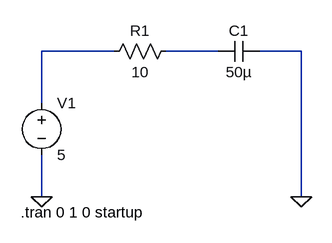
[diagram p0: schematic RC.asc]
RC.asc, the LTspice schematic file:
Version 4
SHEET 1 880 680
WIRE 144 64 32 64
WIRE 304 64 224 64
WIRE 432 64 368 64
WIRE 32 144 32 64
WIRE 32 288 32 224
WIRE 432 288 432 64
FLAG 32 288 0
FLAG 432 288 0
SYMBOL voltage 32 128 R0
WINDOW 123 0 0 Left 0
WINDOW 39 0 0 Left 0
SYMATTR InstName V1
SYMATTR Value 5
SYMBOL res 240 48 R90
WINDOW 0 0 56 VBottom 2
WINDOW 3 32 56 VTop 2
SYMATTR InstName R1
SYMATTR Value 10
SYMBOL cap 368 48 R90
WINDOW 0 0 32 VBottom 2
WINDOW 3 32 32 VTop 2
SYMATTR InstName C1
SYMATTR Value 50µ
TEXT 0 312 Left 2 !.tran 0 1 0 startup

The netlist it stands for:
* RC.asc
V1 N001 0 5
R1 N002 N001 10
C1 0 N002 50µ
.tran 0 1 0 startup
.backanno
.end